# Altium schematic sheet MCU021_V1.0_eZFET_DCDC.SchDoc: ez-FET: DCDC, Voltage-Divider, Power-Switch
size A3; Date: Not shown in title block; ApprovedBy: Not shown in title block; CheckedBy: Not shown in title block; Author: Not shown in title block; CompanyName: Not shown in title block; Engineer: Not shown in title block; Organization: Not shown in title block; Address1: Not shown in title block; Address2: Not shown in title block; Address3: Not shown in title block; Address4: Not shown in title block; DocumentNumber: 3; Revision: Use project parameter SCH_Rev; SheetNumber: 3; SheetTotal: 5; PageSetup: Record=PageOptions|CenterHorizontal=True|CenterVertical=True|PrintScale=1.00|XCorrection=1.00|YCorrection=1.00|PrintKind=0|BorderSize=5000000|LeftOffset=0|BottomOffset=0|Orientation=2|PaperLength=1000|PaperWidth=1000|Scale=100|PaperSource=15|PrintQuality=600|MediaType=1|DitherType=10|PaperKind=Letter|PrintScaleMode=1; CurrentTime: Not shown in title block; CurrentDate: Not shown in title block; Time: Not shown in title block; DocumentFullPathAndName: Not shown in title block; DocumentName: Not shown in title block; ModifiedDate: Not shown in title block; ImagePath: Not shown in title block
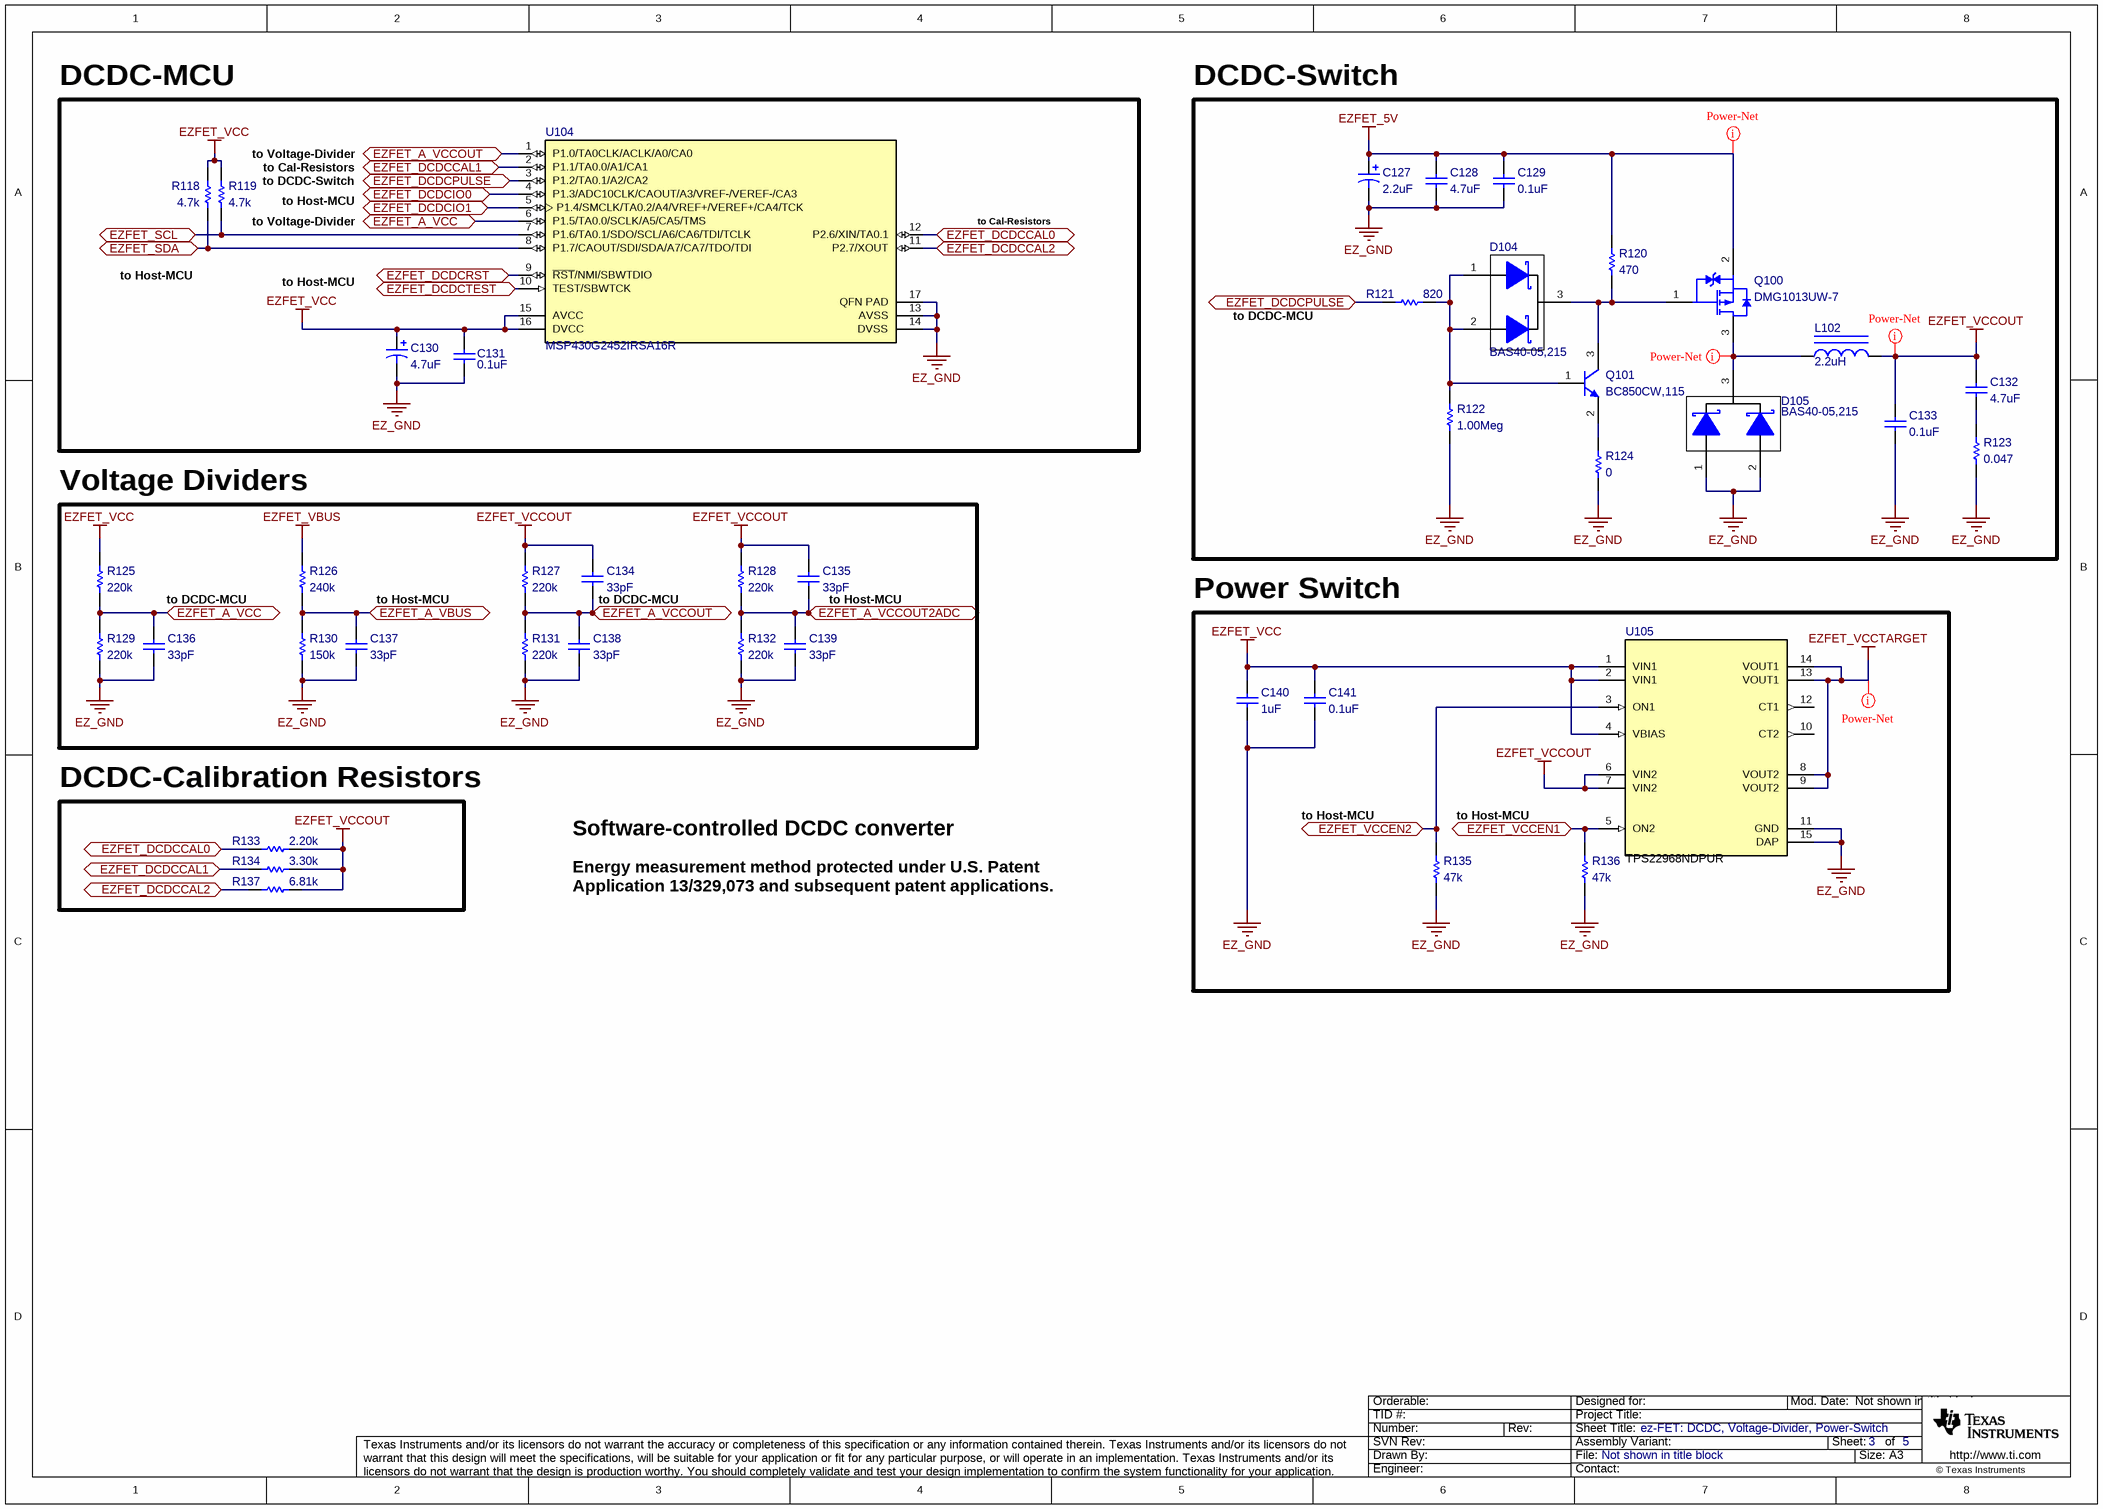
[diagram p0: MCU021_V1.0_eZFET_DCDC.SchDoc]

## Parts
C127  2.2uF  [3216-18]
C128  4.7uF  [0805_HV]
C129  0.1uF  [0402]
C130  4.7uF  [3216-18]
C131  0.1uF  [0402]
C132  4.7uF  [0603]
C133  0.1uF  [0402]
C134  33pF  [0402]
C135  33pF  [0402]
C136  33pF  [0402]
C137  33pF  [0402]
C138  33pF  [0402]
C139  33pF  [0402]
C140  1uF  [0402]
C141  0.1uF  [0402]
D104  BAS40-05,215  [SOT-23]
D105  BAS40-05,215  [SOT-23]
L102  2.2uH  [CBC2518]
Q100  DMG1013UW-7  [SOT-323]
Q101  BC850CW,115  [SOT-323]
R118  4.7k  [0402]
R119  4.7k  [0402]
R120  470  [0402]
R121  820  [0402]
R122  1.00Meg  [0402]
R123  0.047  [0603]
R124  0  [0402]
R125  220k  [0402]
R126  240k  [0402]
R127  220k  [0603]
R128  220k  [0603]
R129  220k  [0402]
R130  150k  [0402]
R131  220k  [0603]
R132  220k  [0603]
R133  2.20k  [0402]
R134  3.30k  [0402]
R135  47k  [0402]
R136  47k  [0402]
R137  6.81k  [0402]
U104  MSP430G2452IRSA16R  [RSA0016B]
U105  TPS22968NDPUR  [DPU0014A]

## Blocks framed on the sheet
DCDC-MCU: C130 C131 R118 R119 U104
DCDC-Switch: C127-C129 C132 C133 D104 D105 L102 Q100 Q101 R120-R124
Voltage Dividers: C134-C139 R125-R132
Power Switch: C140 C141 R135 R136 U105
DCDC-Calibration Resistors: R133 R134 R137

## Ports
EZFET_A_VBUS (bidir), EZFET_A_VCC (bidir), EZFET_A_VCCOUT2ADC (bidir), EZFET_A_VCCOUT (bidir), EZFET_DCDCCAL0 (bidir), EZFET_DCDCCAL1 (bidir), EZFET_DCDCCAL2 (bidir), EZFET_DCDCIO0 (bidir), EZFET_DCDCIO1 (bidir), EZFET_DCDCPULSE (bidir), EZFET_DCDCRST (bidir), EZFET_DCDCTEST (bidir), EZFET_SCL (bidir), EZFET_SDA (bidir), EZFET_VCCEN1 (bidir), EZFET_VCCEN2 (bidir)

## Nets
EZ_GND: C127.2(-) C128.2 C129.2 C130.2(-) C131.2 C133.2 C136.2 C137.2 C138.2 C139.2 C140.2 C141.1 D105.1(A) D105.2(A) R122.1 R123.1 R124.1 R129.1 R130.1 R131.1 R132.1 R135.1 R136.1 U104.13(AVSS) U104.14(DVSS) U104.17(QFN_PAD) U105.11(GND) U105.15(DAP)
EZFET_5V: C127.1(+) C128.1 C129.1 Q100.2(S) R120.2
EZFET_VBUS: R126.2
EZFET_VCC: C130.1(+) C131.1 C140.1 C141.2 R118.2 R119.2 R125.2 U104.15(AVCC) U104.16(DVCC) U105.1(VIN1) U105.2(VIN1) U105.4(VBIAS)
EZFET_VCCOUT: C132.1 C133.1 C134.1 C135.1 L102.2 R127.2 R128.2 R133.2 R134.2 R137.2 U105.6(VIN2) U105.7(VIN2)
EZFET_VCCTARGET: U105.8(VOUT2) U105.9(VOUT2) U105.13(VOUT1) U105.14(VOUT1)
EZFET_A_VBUS: C137.1 R126.1 R130.2 ; port EZFET_A_VBUS
EZFET_A_VCC: C136.1 R125.1 R129.2 U104.6(P1.5/TA0.0/SCLK/A5/CA5/TMS) ; port EZFET_A_VCC
EZFET_A_VCCOUT: C134.2 C138.1 R127.1 R131.2 U104.1(P1.0/TA0CLK/ACLK/A0/CA0) ; port EZFET_A_VCCOUT
EZFET_A_VCCOUT2ADC: C135.2 C139.1 R128.1 R132.2 ; port EZFET_A_VCCOUT2ADC
EZFET_DCDCCAL0: R133.1 U104.12(P2.6/XIN/TA0.1) ; port EZFET_DCDCCAL0
EZFET_DCDCCAL1: R134.1 U104.2(P1.1/TA0.0/A1/CA1) ; port EZFET_DCDCCAL1
EZFET_DCDCCAL2: R137.1 U104.11(P2.7/XOUT) ; port EZFET_DCDCCAL2
EZFET_DCDCIO0: U104.4(P1.3/ADC10CLK/CAOUT/A3/VREF-/VEREF-/CA3) ; port EZFET_DCDCIO0
EZFET_DCDCIO1: U104.5(P1.4/SMCLK/TA0.2/A4/VREF+/VEREF+/CA4/TCK) ; port EZFET_DCDCIO1
EZFET_DCDCPULSE: R121.1 U104.3(P1.2/TA0.1/A2/CA2) ; port EZFET_DCDCPULSE
EZFET_DCDCRST: U104.9(~{RST}/NMI/SBWTDIO) ; port EZFET_DCDCRST
EZFET_DCDCTEST: U104.10(TEST/SBWTCK) ; port EZFET_DCDCTEST
EZFET_SCL: R119.1 U104.7(P1.6/TA0.1/SDO/SCL/A6/CA6/TDI/TCLK) ; port EZFET_SCL
EZFET_SDA: R118.1 U104.8(P1.7/CAOUT/SDI/SDA/A7/CA7/TDO/TDI) ; port EZFET_SDA
EZFET_VCCEN1: R136.2 U105.5(ON2) ; port EZFET_VCCEN1
EZFET_VCCEN2: R135.2 U105.3(ON1) ; port EZFET_VCCEN2
NetC132_2: C132.2 R123.2
NetD104_1: D104.1(A) D104.2(A) Q101.1(B) R121.2 R122.2
NetD104_3: D104.3(K) Q100.1(G) Q101.3(C) R120.1
NetD105_3: D105.3(K) L102.1 Q100.3(D)
NetQ101_2: Q101.2(E) R124.2

Not connected (* = marked no-connect by the designer): U105 10(CT2) 12(CT1)

## Layout directives
net class Power-Net: EZFET_5V, EZFET_VCCOUT, EZFET_VCCTARGET, NetD105_3

## Notes on the sheet
- to Voltage-Divider
- to Cal-Resistors
- to DCDC-Switch
- to Host-MCU
- to DCDC-MCU
- (near C137) to Host-MCU
- (near C134) to DCDC-MCU
- (near C135) to Host-MCU
- Software-controlled DCDC converter
- Energy measurement method protected under U.S. Patent
  Application 13/329,073 and subsequent patent applications.
- Drawn By:
- SVN Rev:
- Number:
- TID #:
- Orderable:
- Rev:
- Sheet Title:
- File:
- Project Title:
- Designed for:
- Assembly Variant:
- Mod. Date:
- Sheet:
- Size:
- of
- A3
- http://www.ti.com
- Texas Instruments and/or its licensors do not warrant the accuracy or completeness of this specification or any information contained therein. Texas Instruments and/or its licensors do not warrant that this design will meet the specifications, will be suitable for your application or fit for any particular purpose, or will operate in an implementation. Texas Instruments and/or its licensors do not warrant that the design is production worthy. You should completely validate and test your design implementation to confirm the system functionality for your application.
- Engineer:
- Contact:
- © Texas Instruments

## Library data of the parts
C127 = 293D225X9025A2TE3: CAP, TA, 2.2 µF, 25 V, +/- 10%, 6.3 ohm, SMD; Manufacturer: Vishay-Sprague; Polarized: Y; CompType: Capacitor; ValueDisplayed: 2.2µF; U/M: EA; Cap_F: 0.0000022; Tolerance_%: 10; Value1: 6.3 ohm; VDC_V: 25; Value2: 25V; ESR_ohm: 6.3; IRMS_A: 0.11; TaMin_C: -55; TaMax_C: 125; Cap_Case: A; SizeAreaWB_mm2: 10.92; SizeArea_mm2: 5.12; SizeX_mm: 3.2; SizeY_mm: 1.6; SizeZ_mm: 1.8; AEC Category: Q200; SymbolVersion: 2008-07-09; Value: 2.2uF; PartNumber: 293D225X9025A2TE3; PackageReference: 3216-18; RoHS: Y; MountType: SMT; Technology: TA; Series: 293D; Publisher: Texas Instruments; LatestRevisionDate: 2017-03-13; LatestRevisionNote: Updated supplier links; ComponentLink1Description: Datasheet link; ComponentLink1URL: http://www.vishay.com/docs/40002/293d.pdf; Supplier 1: Digi-Key; Supplier Part Number 1: 718-1134-1-ND; Supplier 2: Newark; Supplier Part Number 2: 09K6176; Supplier 3: Mouser; Supplier Part Number 3: 74-293D225X9025A2TE3; AEC Qualified: ?
C128 = C0805C475K8PACTU: CAP, CERM, 4.7 µF, 10 V,+/- 10%, X5R, 0805; Manufacturer: Kemet; Polarized: N; CompType: Capacitor; ValueDisplayed: 4.7µF; U/M: EA; Cap_F: 0.0000047; Tolerance_%: 10; ESR_ohm: 0.004; Value1: 0.004 ohm; Value2: 10V; IRMS_A: 9.89; TaMin_C: -55; TaMax_C: 85; Cap_Case: 0805; SizeArea_mm2: 2.5; SizeAreaWB_mm2: 6.75; SizeX_mm: 2; SizeY_mm: 1.25; SizeZ_mm: 1.45; AEC Category: Q200; Green_Lifecycle: Active; Green_REACh: Passed; SymbolVersion: 2008-07-09; Value: 4.7uF; PartNumber: C0805C475K8PACTU; PackageReference: 0805; RoHS: Y; VDC_V: 10; MountType: SMT; Technology: Ceramic; TempCo: X5R; Published: 2008-06-19; Publisher: Texas Instruments; LatestRevisionDate: 2017-05-28; ComponentLink1Description: Datasheet link; ComponentLink1URL: http://www.kemet.com/kemet/web/homepage/kechome.nsf/file/Partial%20Copy%20-%20Ceramic%20Surface%20Mount%20Capacitors/$file/F3102_CE.pdf; Supplier 1: Digi-Key; Supplier Part Number 1: 399-3133-1-ND; Supplier 2: Newark; Supplier Part Number 2: 70K9144; Supplier 3: Mouser; Supplier Part Number 3: 80-C0805C475K8P; AEC Qualified: ?; Green_EU RoHS: Passed; Green_EU RoHS-2: Passed
C129 C131 C141 = GRM155R61A104KA01D: CAP, CERM, 0.1 µF, 10 V,+/- 10%, X5R, 0402; Manufacturer: MuRata; Polarized: N; CompType: Capacitor; ValueDisplayed: 0.1µF; U/M: EA; Cap_F: 0.0000001; Tolerance_%: 10; Value1: Unknown; Value2: 10V; TaMin_C: -55; TaMax_C: 85; SizeArea_mm2: 0.5; SizeAreaWB_mm2: 3; SizeX_mm: 1; SizeZ_mm: 0.6; AEC Category: Q200; Green_Lifecycle: Active; Green_REACh: Passed; SymbolVersion: 2008-07-09; Value: 0.1uF; PartNumber: GRM155R61A104KA01D; PackageReference: 0402; RoHS: Y; VDC_V: 10; MountType: SMT; Technology: Ceramic; TempCo: X5R; Cap_Case: 0402; SizeY_mm: 0.5; Published: 2008-06-19; Publisher: Texas Instruments; LatestRevisionDate: 2017-05-28; ComponentLink1Description: Datasheet link; ComponentLink1URL: http://search.murata.co.jp/Ceramy/PnsearchViewAction.do?HnOFG=ON&HnNFG=ON&SEL_CNT=50&sLang=en&sKey=GRM155R61A104KA01D&x=9&y=9&search=startwith; Supplier 1: Digi-Key; Supplier Part Number 1: 490-1318-1-ND; Supplier 2: Mouser; Supplier Part Number 2: 81-GRM155R61A104KA01; Supplier 3: Farnell; Supplier Part Number 3: 1828862; AEC Qualified: ?; Green_EU RoHS: Passed; Green_EU RoHS-2: Incomplete
C130 = 293D475X9010A2TE3: CAP, TA, 4.7 µF, 10 V, +/- 10%, 5 ohm, SMD; Manufacturer: Vishay-Sprague; Polarized: Y; CompType: Capacitor; ValueDisplayed: 4.7µF; U/M: EA; Cap_F: 0.0000047; Tolerance_%: 10; Value1: 5 ohm; Value2: 10V; ESR_ohm: 5; IRMS_A: 0.12; TaMin_C: -55; TaMax_C: 125; Cap_Case: A; SizeAreaWB_mm2: 10.92; SizeArea_mm2: 5.12; SizeX_mm: 3.2; SizeY_mm: 1.6; SizeZ_mm: 1.8; AEC Category: Q200; SymbolVersion: 2008-07-09; Value: 4.7uF; PartNumber: 293D475X9010A2TE3; PackageReference: 3216-18; RoHS: Y; VDC_V: 10; MountType: SMT; Technology: TA; Series: 293D; Publisher: Texas Instruments; LatestRevisionDate: 2017-03-13; LatestRevisionNote: Updated supplier links; ComponentLink1Description: Datasheet link; ComponentLink1URL: http://www.vishay.com/docs/40002/293d.pdf; Supplier 1: Digi-Key; Supplier Part Number 1: 718-1146-1-ND; Supplier 2: Mouser; Supplier Part Number 2: 74-293D475X9010A2TE3; Supplier 3: Farnell; Supplier Part Number 3: 197397; AEC Qualified: ?
C132 = CGB3B1X5R1A475K055AC: CAP, CERM, 4.7 µF, 10 V,+/- 10%, X5R, 0603; Manufacturer: TDK; Polarized: N; CompType: Capacitor; ValueDisplayed: 4.7µF; U/M: EA; Cap_F: 0.0000047; Tolerance_%: 10; Value1: Unknown; Value2: 10V; TaMin_C: -55; TaMax_C: 85; SizeArea_mm2: 1.28; SizeAreaWB_mm2: 4.68; SizeX_mm: 1.6; SizeY_mm: 0.8; SizeZ_mm: 1; AEC Category: Q200; Green_Lifecycle: Active; Green_REACh: Passed; SymbolVersion: 2008-07-09; Value: 4.7uF; PartNumber: CGB3B1X5R1A475K055AC; PackageReference: 0603; RoHS: Y; VDC_V: 10; MountType: SMT; Technology: Ceramic; TempCo: X5R; Cap_Case: 0603; Published: 2008-06-19; Publisher: Texas Instruments; LatestRevisionDate: 2017-05-28; ComponentLink1Description: Datasheet link; ComponentLink1URL: http://www.tdk.com/pdf/mlcc_product_guide_A12.pdf; Supplier 1: Digi-Key; Supplier Part Number 1: 445-7482-1-ND; AEC Qualified: ?; Green_EU RoHS: Passed; Green_EU RoHS-2: Passed
C133 = C1005X5R1A104K050BA: CAP, CERM, 0.1 µF, 10 V,+/- 10%, X5R, 0402; Manufacturer: TDK; Polarized: N; CompType: Capacitor; ValueDisplayed: 0.1µF; U/M: EA; Cap_F: 0.0000001; Tolerance_%: 10; Value1: Unknown; Value2: 10V; TaMin_C: -55; TaMax_C: 85; SizeArea_mm2: 0.5; SizeAreaWB_mm2: 3; SizeX_mm: 1; SizeZ_mm: 0.6; AEC Category: Q200; Green_Lifecycle: NRND; Green_REACh: Passed; SymbolVersion: 2008-07-09; Value: 0.1uF; PartNumber: C1005X5R1A104K050BA; PackageReference: 0402; RoHS: Y; VDC_V: 10; MountType: SMT; Technology: Ceramic; TempCo: X5R; Cap_Case: 0402; SizeY_mm: 0.5; Published: 2008-06-19; Publisher: Texas Instruments; LatestRevisionDate: 2017-05-28; ComponentLink1Description: Datasheet link; ComponentLink1URL: http://product.tdk.com/en/catalog/datasheets/mlcc_commercial_general_en.pdf; Supplier 1: Digi-Key; Supplier Part Number 1: 445-1265-1-ND; Supplier 2: Newark; Supplier Part Number 2: 90R7585; Supplier 3: Mouser; Supplier Part Number 3: 810-C1005X5R1A104K; AEC Qualified: ?; Green_EU RoHS: Passed; Green_EU RoHS-2: Passed
C134-C139 = C1005C0G1H330J050BA: CAP, CERM, 33 pF, 50 V,+/- 5%, C0G/NP0, 0402; Manufacturer: TDK; Polarized: N; CompType: Capacitor; U/M: EA; Cap_F: 0.000000000033; Tolerance_%: 5; Value1: Unknown; VDC_V: 50; Value2: 50V; TaMin_C: -55; TaMax_C: 125; SizeArea_mm2: 0.5; SizeAreaWB_mm2: 3; SizeX_mm: 1; SizeZ_mm: 0.6; AEC Category: Q200; Green_Lifecycle: Not Set; Green_REACh: Incomplete; SymbolVersion: 2008-07-09; Value: 33pF; PartNumber: C1005C0G1H330J050BA; ValueDisplayed: 33pF; PackageReference: 0402; RoHS: Y; MountType: SMT; Technology: Ceramic; TempCo: C0G/NP0; Cap_Case: 0402; SizeY_mm: 0.5; Published: 2008-06-19; Publisher: Texas Instruments; LatestRevisionDate: 2017-05-28; ComponentLink1Description: Datasheet link; ComponentLink1URL: http://product.tdk.com/en/catalog/datasheets/mlcc_commercial_general_en.pdf; Supplier 1: Digi-Key; Supplier Part Number 1: 445-1241-1-ND; Supplier 2: Newark; Supplier Part Number 2: 72W1722; Supplier 3: Mouser; Supplier Part Number 3: 810-C1005C0G1H330J; AEC Qualified: ?; Green_EU RoHS: Incomplete; Green_EU RoHS-2: Incomplete
C140 = GRM155R61A105KE15D: CAP, CERM, 1 µF, 10 V,+/- 10%, X5R, 0402; Manufacturer: MuRata; Polarized: N; CompType: Capacitor; ValueDisplayed: 1µF; U/M: EA; Cap_F: 0.000001; Tolerance_%: 10; Value1: Unknown; Value2: 10V; TaMin_C: -55; TaMax_C: 85; SizeArea_mm2: 0.5; SizeAreaWB_mm2: 3; SizeX_mm: 1; SizeZ_mm: 0.6; AEC Category: Q200; Green_Lifecycle: Active; Green_REACh: Passed; SymbolVersion: 2008-07-09; Value: 1uF; PartNumber: GRM155R61A105KE15D; PackageReference: 0402; RoHS: Y; VDC_V: 10; MountType: SMT; Technology: Ceramic; TempCo: X5R; Cap_Case: 0402; SizeY_mm: 0.5; Published: 2008-06-19; Publisher: Texas Instruments; LatestRevisionDate: 2017-05-28; ComponentLink1Description: Datasheet link; ComponentLink1URL: http://search.murata.co.jp/Ceramy/PnsearchViewAction.do?HnOFG=ON&HnNFG=ON&SEL_CNT=50&sLang=en&sKey=GRM155R61A105KE15D&x=9&y=9&search=startwith; Supplier 1: Digi-Key; Supplier Part Number 1: 490-3890-1-ND; Supplier 2: Mouser; Supplier Part Number 2: 81-GRM155R61A105KE15; Supplier 3: Farnell; Supplier Part Number 3: 1735523; AEC Qualified: ?; Green_EU RoHS: Passed; Green_EU RoHS-2: Incomplete
D104 D105 = BAS40-05,215: Diode, Schottky, 40 V, 0.12 A, AEC-Q101, SOT-23; Manufacturer: Nexperia; SymbolCreator: a0412235; U/M: EA; Vf_V: 0.38; Value: 40V; Value1: 0.12A; Value2: 0.38V; Io_A: 0.12; Vr_V: 40; TJmax_C: 150; SizeAreaWB_mm2: 14; SizeArea_mm2: 7.5; SizeX_mm: 2.5; SizeY_mm: 3; SizeZ_mm: 1.1; AEC Category: Q101; AEC Qualified: Y; SymbolVersion: 2013-03-27; PartNumber: BAS40-05,215; PackageReference: SOT-23; CompType: Diode; MountType: SMT; Type: Schottky; RoHS: Y; Published: 2008-06-26; Publisher: Texas Instruments; LatestRevisionDate: 2017-06-06; ComponentLink1Description: Datasheet link; ComponentLink1URL: https://assets.nexperia.com/documents/data-sheet/BAS40_1PSXXSB4X_SER.pdf; Supplier 1: Digi-Key; Supplier Part Number 1: 1727-4235-1-ND; Supplier 2: Newark; Supplier Part Number 2: 75R4943; Supplier 3: Mouser; Supplier Part Number 3: 771-BAS40-05-T/R
L102 = CBC2518T2R2M: Inductor, Wirewound, Ceramic, 2.2 µH, 0.89 A, 0.13 ohm, SMD; Manufacturer: Taiyo Yuden; ValueDisplayed: 2.2µH; Ind_H: 2.2E-6; Imax_A: 0.89; Irms: 1.1A @ 40C rise; Isat: 0.89A @ 30% inductance drop; DCR_ohm: 0.13; Value2: 0.89A; SizeAreaWB_mm2: 9.8; SizeArea_mm2: 4.5; SizeX_mm: 2.5; SizeY_mm: 1.8; AEC Category: Q200; AEC Qualified: N; Green_Lifecycle: Active; Green_REACh: Passed; SymbolVersion: 2008-07-23; CompType: Inductor; Value: 2.2uH; PartNumber: CBC2518T2R2M; Value1: 0.13 ohm; Technology: Wirewound; MountType: SMT; Material: Ceramic; PackageReference: 2.5x1.8x1.8mm; Published: 2008-06-26; Publisher: Texas Instruments; LatestRevisionDate: 2017-05-30; ComponentLink1Description: Datasheet link; ComponentLink1URL: http://www.yuden.co.jp/productdata/catalog/en/wound02_e.pdf; RoHS: Y; SizeZ_mm: 1.8; Supplier 1: Digi-Key; Supplier Part Number 1: 587-1618-1-ND; Supplier 2: Newark; Supplier Part Number 2: 18J0834; Supplier 3: Mouser; Supplier Part Number 3: 963-CBC2518T2R2M; AEC Grade: N/A; Green_EU RoHS: Passed; Green_EU RoHS-2: Passed
Q100 = DMG1013UW-7: MOSFET, P-CH, -20 V, -0.82 A, SOT-323; Manufacturer: Diodes Inc.; Alternate Manufacturer: None; SymbolCreator: a0411947; U/M: EA; ChType: P; Value: -20V; Value1: 0.75 ohm; Rdson45_ohm: 0.75; Value2: 0.622 nC; QgTyp_nC: 0.622; Vgs_V: -6; SizeAreaWB_mm2: 10.24; SizeArea_mm2: 4.84; SizeX_mm: 2.2; SizeZ_mm: 1.1; AEC Category: Q101; Green_Lifecycle: Active; Green_REACh: Passed; SymbolVersion: 2013-05-16; PartNumber: DMG1013UW-7; PackageReference: SOT-323; CompType: MOSFET; VdsMax_V: -20; IdsMax_A: -0.82; SizeY_mm: 2.2; RoHS: Y; MountType: SMT; Published: 2008-06-19; Publisher: Texas Instruments; LatestRevisionDate: 2017-05-30; LatestRevisionNote: Added parts.; ComponentLink1Description: Datasheet link; ComponentLink1URL: http://www.diodes.com/datasheets/ds31861.pdf; Supplier 1: Digi-Key; Supplier Part Number 1: DMG1013UW-7DICT-ND; Supplier 2: Mouser; Supplier Part Number 2: 621-DMG1013UW-7; AEC Qualified: ?; Green_EU RoHS: Passed; Green_EU RoHS-2: Passed
Q101 = BC850CW,115, Nexperia: Transistor, NPN, 45 V, 0.1 A, SOT-323; CompType: BJT; PNP: 0; NPN: 1; Vceo_V: 45; Vcesat1_V: 0.25; Value: 45 V; IcRated_A: 0.1; Value1: 0.1 A; HfeMax: 800; TaMin_C: -65; TaMax_C: 150; SizeAreaWB_mm2: 10.24; SizeArea_mm2: 4.84; SizeX_mm: 2.2; SizeZ_mm: 1.1; U/M: EA; AEC Category: Q101; SymbolVersion: 2008-07-31; PartNumber: BC850CW,115; Manufacturer: Nexperia; PackageReference: SOT-323; RoHS: Y; Value2: 800; SizeY_mm: 2.2; Published: 2008-07-31; LatestRevisionDate: 2017-04-05; Publisher: Texas Instruments; ComponentLink1Description: Datasheet link; ComponentLink1URL: http://www.nexperia.com/documents/data_sheet/BC849W_850W.pdf; Supplier 1: Digi-Key; Supplier Part Number 1: 568-6076-1-ND; Supplier 2: Newark; Supplier Part Number 2: 75R0746; Supplier 3: Mouser; Supplier Part Number 3: 771-BC850CW-T/R; MountType: SMT; AEC Qualified: ?
R118 R119 = CRCW04024K70JNED: RES, 4.7 k, 5%, 0.063 W, 0402; Manufacturer: Vishay-Dale; CompType: Resistor; Res_ohm: 4700; Value_Code: 4k70; Tolerance_%: 5; Power_W: 0.063; Value2: 0.063W; VDC_V: 50; TempCo: 200 ppm/C; SizeArea_mm2: 0.5; SizeX_mm: 1; SizeZ_mm: 0.6; EIA_Code: E24; U/M: EA; AEC Category: Q200; SymbolVersion: 2009-05-29; Value: 4.7k; PartNumber: CRCW04024K70JNED; ValueDisplayed: 4.7k; PackageReference: 0402; RoHS: Y; Value1: 5%; MountType: SMT; Technology: Thick Film; SizeY_mm: 0.5; Published: 2008-06-26; Publisher: Texas Instruments; LatestRevisionDate: 2017-04-13; ComponentLink1Description: Datasheet link; ComponentLink1URL: http://www.vishay.com/docs/20035/dcrcwe3.pdf; Supplier 1: Digi-Key; Supplier Part Number 1: 541-4.7KJCT-ND; Supplier 2: Newark; Supplier Part Number 2: 59M6733; Supplier 3: Mouser; Supplier Part Number 3: 71-CRCW0402J-4.7K-E3; AEC Qualified: ?
R120 = RC0402FR-07470RL: RES, 470, 1%, 0.063 W, 0402; Manufacturer: Yageo America; CompType: Resistor; Value_Code: 470R; Tolerance_%: 1; Power_W: 0.063; Value2: 0.063W; VDC_V: 50; TempCo: 100 ppm/C; SizeArea_mm2: 0.5; SizeZ_mm: 0.6; U/M: EA; AEC Category: Q200; AEC Qualified: N; SymbolVersion: 2009-05-29; Value: 470; PartNumber: RC0402FR-07470RL; ValueDisplayed: 470; PackageReference: 0402; RoHS: Y; Res_ohm: 470; Value1: 1%; MountType: SMT; Technology: Thick Film; SizeX_mm: 1; SizeY_mm: 0.5; Published: 2008-06-26; Publisher: Texas Instruments; LatestRevisionDate: 2017-04-13; ComponentLink1Description: Datasheet link; ComponentLink1URL: http://www.yageo.com/documents/recent/PYu-RC_Group_51_RoHS_L_04.pdf; Supplier 1: Digi-Key; Supplier Part Number 1: 311-470LRCT-ND; Supplier 2: Newark; Supplier Part Number 2: 67R9940; Supplier 3: Mouser; Supplier Part Number 3: 603-RC0402FR-07470RL; AEC Grade: N/A
R121 = RC0402FR-07820RL: RES, 820, 1%, 0.063 W, 0402; Manufacturer: Yageo America; CompType: Resistor; Value_Code: 820R; Tolerance_%: 1; Power_W: 0.063; Value2: 0.063W; VDC_V: 50; TempCo: 100 ppm/C; SizeArea_mm2: 0.5; SizeZ_mm: 0.6; U/M: EA; AEC Category: Q200; AEC Qualified: N; SymbolVersion: 2009-05-29; Value: 820; PartNumber: RC0402FR-07820RL; ValueDisplayed: 820; PackageReference: 0402; RoHS: Y; Res_ohm: 820; Value1: 1%; MountType: SMT; Technology: Thick Film; SizeX_mm: 1; SizeY_mm: 0.5; Published: 2008-06-26; Publisher: Texas Instruments; LatestRevisionDate: 2017-04-13; ComponentLink1Description: Datasheet link; ComponentLink1URL: http://www.yageo.com/documents/recent/PYu-RC_Group_51_RoHS_L_04.pdf; Supplier 1: Digi-Key; Supplier Part Number 1: 311-820LRCT-ND; Supplier 2: Newark; Supplier Part Number 2: 26M6794; Supplier 3: Mouser; Supplier Part Number 3: 603-RC0402FR-07820RL; AEC Grade: N/A
R122 = CRCW04021M00FKED: RES, 1.00 M, 1%, 0.063 W, 0402; Manufacturer: Vishay-Dale; CompType: Resistor; ValueDisplayed: 1.00M; Res_ohm: 1000000; Value_Code: 1M00; Tolerance_%: 1; Power_W: 0.063; Value2: 0.063W; VDC_V: 50; TempCo: 100 ppm/C; SizeArea_mm2: 0.5; SizeZ_mm: 0.6; EIA_Code: E96; U/M: EA; AEC Category: Q200; SymbolVersion: 2009-05-29; Value: 1.00Meg; PartNumber: CRCW04021M00FKED; PackageReference: 0402; RoHS: Y; Value1: 1%; MountType: SMT; Technology: Thick Film; SizeX_mm: 1; SizeY_mm: 0.5; Published: 2008-06-26; Publisher: Texas Instruments; LatestRevisionDate: 2017-04-13; ComponentLink1Description: Datasheet link; ComponentLink1URL: http://www.vishay.com/docs/20035/dcrcwe3.pdf; Supplier 1: Digi-Key; Supplier Part Number 1: 541-1.00MLCT-ND; Supplier 2: Newark; Supplier Part Number 2: 52K6593; Supplier 3: Mouser; Supplier Part Number 3: 71-CRCW0402-1.0M-E3; AEC Qualified: ?
R123 = ERJ-L03KF47MV: RES, 0.047, 1%, 0.1 W, 0603; Manufacturer: Panasonic; CompType: Resistor; Value_Code: R047; Tolerance_%: 1; Power_W: 0.1; Value2: 0.1W; TempCo: 200 ppm/C; SizeArea_mm2: 1.28; SizeX_mm: 1.6; SizeY_mm: 0.8; EIA_Code: E96; U/M: EA; AEC Category: Q200; Green_Lifecycle: Not Set; Green_REACh: Incomplete; SymbolVersion: 2009-05-29; Value: 0.047; PartNumber: ERJ-L03KF47MV; ValueDisplayed: 0.047; PackageReference: 0603; RoHS: Y; Res_ohm: 0.047; Value1: 1%; MountType: SMT; Technology: Thick Film; SizeZ_mm: 1; Published: 2008-06-26; Publisher: Texas Instruments; LatestRevisionDate: 2017-05-04; ComponentLink1Description: Datasheet link; ComponentLink1URL: http://www.panasonic.com/industrial/components/pdf/AOA0000CE3.pdf; Supplier 1: Digi-Key; Supplier Part Number 1: P47LJCT-ND; Supplier 2: Mouser; Supplier Part Number 2: 667-ERJ-L03KF47MV; Supplier 3: Farnell; Supplier Part Number 3: 1577548; AEC Qualified: ?; Green_EU RoHS: Incomplete; Green_EU RoHS-2: Incomplete
R124 = RC0402JR-070RL: RES, 0, 5%, 0.063 W, 0402; Manufacturer: Yageo America; CompType: Resistor; Value_Code: 0000; Tolerance_%: 5; Power_W: 0.063; Value2: 0.063W; VDC_V: 50; TempCo: 200 ppm/C; SizeArea_mm2: 0.5; SizeX_mm: 1; SizeZ_mm: 0.6; EIA_Code: E24; U/M: EA; AEC Category: Q200; SymbolVersion: 2009-05-29; Value: 0; PartNumber: RC0402JR-070RL; ValueDisplayed: 0; PackageReference: 0402; RoHS: Y; Res_ohm: 0; Value1: 5%; MountType: SMT; Technology: Thick Film; SizeY_mm: 0.5; Published: 2008-06-26; Publisher: Texas Instruments; LatestRevisionDate: 2017-04-13; ComponentLink1Description: Datasheet link; ComponentLink1URL: http://www.yageo.com/pdf/Pu-RC0402_51_PbFree_L_2.pdf; Supplier 1: Digi-Key; Supplier Part Number 1: 311-0.0JRCT-ND; Supplier 2: Mouser; Supplier Part Number 2: 603-RC0402JR-070RL; Supplier 3: Farnell; Supplier Part Number 3: 9232516; AEC Qualified: ?
R125 R129 = RC0402FR-07220KL: RES, 220 k, 1%, 0.0625 W, 0402; Manufacturer: Yageo America; CompType: Resistor; Res_ohm: 220000; Tolerance_%: 1; Power_W: 0.0625; VDC_V: 50; TempCo: 100 ppm/C; SizeArea_mm2: 0.5; SizeZ_mm: 0.6; U/M: EA; AEC Category: Q200; AEC Qualified: N; SymbolVersion: 2009-05-29; Value: 220k; PartNumber: RC0402FR-07220KL; ValueDisplayed: 220k; PackageReference: 0402; RoHS: Y; Value_Code: 220k; Value1: 1%; Value2: 0.0625W; MountType: SMT; Technology: Thick Film; SizeX_mm: 1; SizeY_mm: 0.5; Published: 2008-06-26; Publisher: Texas Instruments; LatestRevisionDate: 2017-06-12; ComponentLink1Description: Datasheet link; ComponentLink1URL: http://www.yageo.com/documents/recent/PYu-RC0402_51_RoHS_L_6_r.pdf; Supplier 1: Digi-Key; Supplier Part Number 1: 311-220KLRCT-ND; Supplier 2: Newark; Supplier Part Number 2: 98K7527; Supplier 3: Mouser; Supplier Part Number 3: 603-RC0402FR-07220KL; AEC Grade: N/A
R126 = CRCW0402240KFKED: RES, 240 k, 1%, 0.063 W, 0402; Manufacturer: Vishay-Dale; CompType: Resistor; Res_ohm: 240000; Tolerance_%: 1; Power_W: 0.063; Value2: 0.063W; VDC_V: 50; TempCo: 100 ppm/C; SizeArea_mm2: 0.5; SizeZ_mm: 0.6; U/M: EA; AEC Category: Q200; SymbolVersion: 2009-05-29; Value: 240k; PartNumber: CRCW0402240KFKED; ValueDisplayed: 240k; PackageReference: 0402; RoHS: Y; Value_Code: 240k; Value1: 1%; MountType: SMT; Technology: Thick Film; SizeX_mm: 1; SizeY_mm: 0.5; Published: 2008-06-26; Publisher: Texas Instruments; LatestRevisionDate: 2017-04-13; ComponentLink1Description: Datasheet link; ComponentLink1URL: http://www.vishay.com/docs/20035/dcrcwe3.pdf; Supplier 1: Digi-Key; Supplier Part Number 1: 541-240KLCT-ND; Supplier 2: Newark; Supplier Part Number 2: 51P0040; Supplier 3: Mouser; Supplier Part Number 3: 71-CRCW0402240KFKED; AEC Qualified: ?
R127 R128 R131 R132 = CPF0603B220KE: RES, 220 k, 0.1%, 0.063 W, 0603; Manufacturer: TE Connectivity; CompType: Resistor; Res_ohm: 220000; Tolerance_%: 0.1; Power_W: 0.063; Value2: 0.063W; VDC_V: 50; TempCo: 25 ppm/C; SizeArea_mm2: 1.28; SizeX_mm: 1.6; SizeY_mm: 0.8; SizeZ_mm: 1; U/M: EA; AEC Category: Q200; AEC Qualified: N; SymbolVersion: 2009-05-29; Value: 220k; PartNumber: CPF0603B220KE; ValueDisplayed: 220k; PackageReference: 0603; RoHS: Y; Value_Code: 220k; Value1: 0.1%; MountType: SMT; Technology: Thin Film; Published: 2008-06-26; Publisher: Texas Instruments; LatestRevisionDate: 2017-05-04; ComponentLink1Description: Datasheet link; ComponentLink1URL: http://www.te.com/commerce/DocumentDelivery/DDEController?Action=srchrtrv&DocNm=1773200&DocType=DS&DocLang=English; Supplier 1: Digi-Key; Supplier Part Number 1: A103064CT-ND; Supplier 2: Newark; Supplier Part Number 2: 95W6624; Supplier 3: Mouser; Supplier Part Number 3: 279-CPF0603B220KE1; AEC Grade: N/A
R130 = CRCW0402150KFKED: RES, 150 k, 1%, 0.063 W, 0402; Manufacturer: Vishay-Dale; CompType: Resistor; Res_ohm: 150000; Tolerance_%: 1; Power_W: 0.063; Value2: 0.063W; VDC_V: 50; TempCo: 100 ppm/C; SizeArea_mm2: 0.5; SizeZ_mm: 0.6; EIA_Code: E96; U/M: EA; AEC Category: Q200; SymbolVersion: 2009-05-29; Value: 150k; PartNumber: CRCW0402150KFKED; ValueDisplayed: 150k; PackageReference: 0402; RoHS: Y; Value_Code: 150k; Value1: 1%; MountType: SMT; Technology: Thick Film; SizeX_mm: 1; SizeY_mm: 0.5; Published: 2008-06-26; Publisher: Texas Instruments; LatestRevisionDate: 2017-04-13; ComponentLink1Description: Datasheet link; ComponentLink1URL: http://www.vishay.com/docs/20035/dcrcwe3.pdf; Supplier 1: Digi-Key; Supplier Part Number 1: 541-150KLCT-ND; Supplier 2: Newark; Supplier Part Number 2: 52K6719; Supplier 3: Mouser; Supplier Part Number 3: 71-CRCW0402-150K-E3; AEC Qualified: ?
R133 = ERA2AEB222X: RES, 2.20 k, 0.1%, 0.0625 W, AEC-Q200 Grade 0, 0402; Manufacturer: Panasonic; CompType: Resistor; Res_ohm: 2200; Value_Code: 2k20; Tolerance_%: 0.1; Power_W: 0.0625; VDC_V: 50; TempCo: 25 ppm/C; SizeArea_mm2: 0.5; SizeX_mm: 1; SizeZ_mm: 0.6; U/M: EA; AEC Category: Q200; AEC Qualified: Y; AEC Grade: 0; SymbolVersion: 2009-05-29; Value: 2.20k; PartNumber: ERA2AEB222X; ValueDisplayed: 2.20k; PackageReference: 0402; RoHS: Y; Value1: 0.1%; Value2: 0.0625W; MountType: SMT; Technology: Thin Film; SizeY_mm: 0.5; Published: 2008-06-26; Publisher: Texas Instruments; LatestRevisionDate: 2017-06-12; ComponentLink1Description: Datasheet link; ComponentLink1URL: https://industrial.panasonic.com/cdbs/www-data/pdf/RDM0000/AOA0000C237.pdf; Supplier 1: Digi-Key; Supplier Part Number 1: P2.2KDCCT-ND; Supplier 2: Newark; Supplier Part Number 2: 05X8513; Supplier 3: Mouser; Supplier Part Number 3: 667-ERA-2AEB222X
R134 = ERA2ARB332X: RES, 3.30 k, 0.1%, 0.0625 W, AEC-Q200 Grade 0, 0402; Manufacturer: Panasonic; CompType: Resistor; Res_ohm: 3300; Value_Code: 3k30; Tolerance_%: 0.1; Power_W: 0.0625; VDC_V: 50; TempCo: 25 ppm/C; SizeArea_mm2: 0.5; SizeX_mm: 1; SizeZ_mm: 0.6; U/M: EA; AEC Category: Q200; AEC Qualified: Y; AEC Grade: 0; SymbolVersion: 2009-05-29; Value: 3.30k; PartNumber: ERA2ARB332X; ValueDisplayed: 3.30k; PackageReference: 0402; RoHS: Y; Value1: 0.1%; Value2: 0.0625W; MountType: SMT; Technology: Thin Film; SizeY_mm: 0.5; Published: 2008-06-26; Publisher: Texas Instruments; LatestRevisionDate: 2017-06-12; ComponentLink1Description: Datasheet link; ComponentLink1URL: https://industrial.panasonic.com/cdbs/www-data/pdf/RDM0000/AOA0000C237.pdf; Supplier 1: Digi-Key; Supplier Part Number 1: P3.3KCPCT-ND; Supplier 2: Newark; Supplier Part Number 2: 85Y5703; Supplier 3: Mouser; Supplier Part Number 3: 667-ERA-2ARB332X
R135 R136 = CRCW040247K0JNED: RES, 47 k, 5%, 0.063 W, 0402; Manufacturer: Vishay-Dale; CompType: Resistor; Res_ohm: 47000; Value_Code: 47k0; Tolerance_%: 5; Power_W: 0.063; Value2: 0.063W; VDC_V: 50; TempCo: 200 ppm/C; SizeArea_mm2: 0.5; SizeX_mm: 1; SizeZ_mm: 0.6; EIA_Code: E24; U/M: EA; AEC Category: Q200; SymbolVersion: 2009-05-29; Value: 47k; PartNumber: CRCW040247K0JNED; ValueDisplayed: 47k; PackageReference: 0402; RoHS: Y; Value1: 5%; MountType: SMT; Technology: Thick Film; SizeY_mm: 0.5; Published: 2008-06-26; Publisher: Texas Instruments; LatestRevisionDate: 2017-04-13; ComponentLink1Description: Datasheet link; ComponentLink1URL: http://www.vishay.com/docs/20035/dcrcwe3.pdf; Supplier 1: Digi-Key; Supplier Part Number 1: 541-47KJCT-ND; Supplier 2: Newark; Supplier Part Number 2: 52K7099; Supplier 3: Mouser; Supplier Part Number 3: 71-CRCW0402-J-47K-E3; AEC Qualified: ?
R137 = ERA2AEB6811X: RES, 6.81 k, 0.1%, 0.0625 W, AEC-Q200 Grade 0, 0402; Manufacturer: Panasonic; CompType: Resistor; Res_ohm: 6810; Value_Code: 6k81; Tolerance_%: 0.1; Power_W: 0.0625; VDC_V: 50; TempCo: 25 ppm/C; SizeArea_mm2: 0.5; SizeX_mm: 1; SizeZ_mm: 0.6; EIA_Code: E192; U/M: EA; AEC Category: Q200; AEC Qualified: Y; AEC Grade: 0; SymbolVersion: 2009-05-29; Value: 6.81k; PartNumber: ERA2AEB6811X; ValueDisplayed: 6.81k; PackageReference: 0402; RoHS: Y; Value1: 0.1%; Value2: 0.0625W; MountType: SMT; Technology: Thin Film; SizeY_mm: 0.5; Published: 2008-06-26; Publisher: Texas Instruments; LatestRevisionDate: 2017-06-12; ComponentLink1Description: Datasheet link; ComponentLink1URL: https://industrial.panasonic.com/cdbs/www-data/pdf/RDM0000/AOA0000C237.pdf; Supplier 1: Digi-Key; Supplier Part Number 1: P6.81KDCCT-ND; Supplier 2: Newark; Supplier Part Number 2: 85Y5585; Supplier 3: Mouser; Supplier Part Number 3: 667-ERA-2AEB6811X
U104 = MSP430G2452IRSA16R: 16 MHz Mixed Signal Microcontroller with 8 KB Flash, 256 B SRAM and 16 GPIOs, 16-pin QFN (RSA), Green (RoHS & no Sb/Br); Alternate Manufacturer: Texas Instruments; Alternate PartNumber: Equivalent; ADC: 10-bit SAR; ADC Channels: 8; Brown Out Reset: Yes; Frequency(MHz): 16; Pin/Package: 14TSSOP, 16QFN, 20PDIP, 20TSSOP; SRAM(B): 256; SubFamily: Value Line; Timers - 16-bit: 1; USI: (I2C/SPI); DatasheetVersion: SLAS722E; PackageVersion: 4205141/D, 06/2011; PackageReference: RSA0016B; PackageDescription: 16-Pin Plastic Flat Pack, Body 4.00 x 4.00 mm, Pitch 0.65 mm; Cap touch I/O: Yes; Comparators: Yes; Eco-Plan: Green (RoHS & no Sb/Br); Flash(KB): 8; GPIO: 16; Temp Sensor: Yes; Watchdog: Yes; MountType: SMT; Code_JEDEC: MO-220; ComponentLink1Description: Manufacturer URL; ComponentLink1URL: http://www.ti.com/; ComponentLink2Description: Datasheet; ComponentLink2URL: http://www.ti.com/general/docs/lit/getliterature.tsp?genericPartNumber=MSP430G2452&fileType=pdf; PartNumber: MSP430G2452IRSA16R; Manufacturer: Texas Instruments
U105 = TPS22968NDPUR: 5.5V, 4A, 25mO, 2-Channel Load Switch With Quick Output Discharge and Adjustable Rise Time, DPU0014A (WSON-14); Manufacturer: Texas Instruments; SymbolCreator: a0411947; SizeArea_mm2: 6; SizeAreaWB_mm2: 12; SizeX_mm: 2; SizeY_mm: 3; SizeZ_mm: 0.8; CompType: IC; U/M: EA; Green_Lifecycle: Active; Green_REACh: Passed; SymbolVersion: 2015-07-19; PartNumber: TPS22968NDPUR; PackageReference: DPU0014A; PackageDescription: WSON-14; MountType: SMT; ComponentLink1Description: Datasheet Link; ComponentLink1URL: http://www.ti.com/lit/ds/symlink/tps22968.pdf; RoHS: Y; Publisher: Texas Instruments; LatestRevisionDate: 2017-05-22; Alternate Manufacturer: Texas Instruments; Green_EU RoHS: Passed; Green_EU RoHS-2: Passed